# EAGLE design badge_arvore_natal (EAGLE 9.6.2)
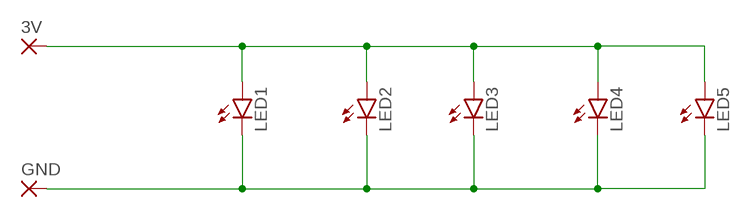
[diagram p0: schematic, sheet 1]

## Parts
3V  SMD2  [SMD1,27-2,54]
GND  SMD2  [SMD1,27-2,54]
LED1  LEDCHIPLED_0805  [CHIPLED_0805]
LED2  LEDCHIPLED_0805  [CHIPLED_0805]
LED3  LEDCHIPLED_0805  [CHIPLED_0805]
LED4  LEDCHIPLED_0805  [CHIPLED_0805]
LED5  LEDCHIPLED_0805  [CHIPLED_0805]

## Nets
N$1: 3V.1(P) LED1.A LED2.A LED3.A LED4.A LED5.A
N$2: GND.1(P) LED1.C LED2.C LED3.C LED4.C LED5.C

## Library data of the parts
3V GND = wirepad:SMD2: SMD PAD
LED1-LED5 = led:LED: LED OSRAM: - CHIPLED LG R971, LG N971, LY N971, LG Q971, LY Q971, LO R971, LY R971 LH N974, LH R974 LS Q976, LO Q976, LY Q976 LO Q996 - Hyper CHIPLED LW Q18S LB Q993, LB Q99A, LB R99A - SideLED LS A670, LO A670, LY A670, LG A670, LP A670 LB A673, LV A673, LT A673, LW A673 LH A674 LY A675 LS A676, LA A676, LO A676, LY A676, LW A676 LS A679, LY A679, LG A679 - Hyper Micro SIDELED® LS Y876, LA Y876, LO Y876, LY Y876 LT Y87S - SmartLED LW L88C, LW L88S LB L89C, LB L89S, LG L890 LS L89K, LO L89K, LY L89K LS L896, LA L896, LO L896, LY L896 - TOPLED LS T670, LO T670, LY T670, LG T670, LP T670 LSG T670, LSP T670, LSY T670, LOP T670, LYG T670 LG T671, LOG T671, LSG T671 LB T673, LV T673, LT T673, LW T673 LH T674 LS T676, LA T676, LO T676, LY T676, LB T676, LH T676, LSB T676, LW T676 LB T67C, LV T67C, LT T67C, LS T67K, LO T67K, LY T67K, LW E67C LS E67B, LA E67B, LO E67B, LY E67B, LB E67C, LV E67C, LT E67C LW T67C LS T679, LY T679, LG T679 LS T770, LO T770, LY T770, LG T770, LP T770 LB T773, LV T773, LT T773, LW T773 LH T774 LS E675, LA E675, LY E675, LS T675 LS T776, LA T776, LO T776, LY T776, LB T776 LHGB T686 LT T68C, LB T68C - Hyper Mini TOPLED® LB M676 - Mini TOPLED Santana® LG M470 LS M47K, LO M47K, LY M47K Source: http://www.osram.convergy.de LUXEON: - LUMILED® LXK2-PW12-R00, LXK2-PW12-S00, LXK2-PW14-U00, LXK2-PW14-V00 LXK2-PM12-R00, LXK2-PM12-S00, LXK2-PM14-U00 LXK2-PE12-Q00, LXK2-PE12-R00, LXK2-PE12-S00, LXK2-PE14-T00, LXK2-PE14-U00 LXK2-PB12-K00, LXK2-PB12-L00, LXK2-PB12-M00, LXK2-PB14-N00, LXK2-PB14-P00, LXK2-PB14-Q00 LXK2-PR12-L00, LXK2-PR12-M00, LXK2-PR14-Q00, LXK2-PR14-R00 LXK2-PD12-Q00, LXK2-PD12-R00, LXK2-PD12-S00 LXK2-PH12-R00, LXK2-PH12-S00 LXK2-PL12-P00, LXK2-PL12-Q00, LXK2-PL12-R00 Source: www.luxeon.com KINGBRIGHT: KA-3528ASYC Source: www.kingbright.com

## Board
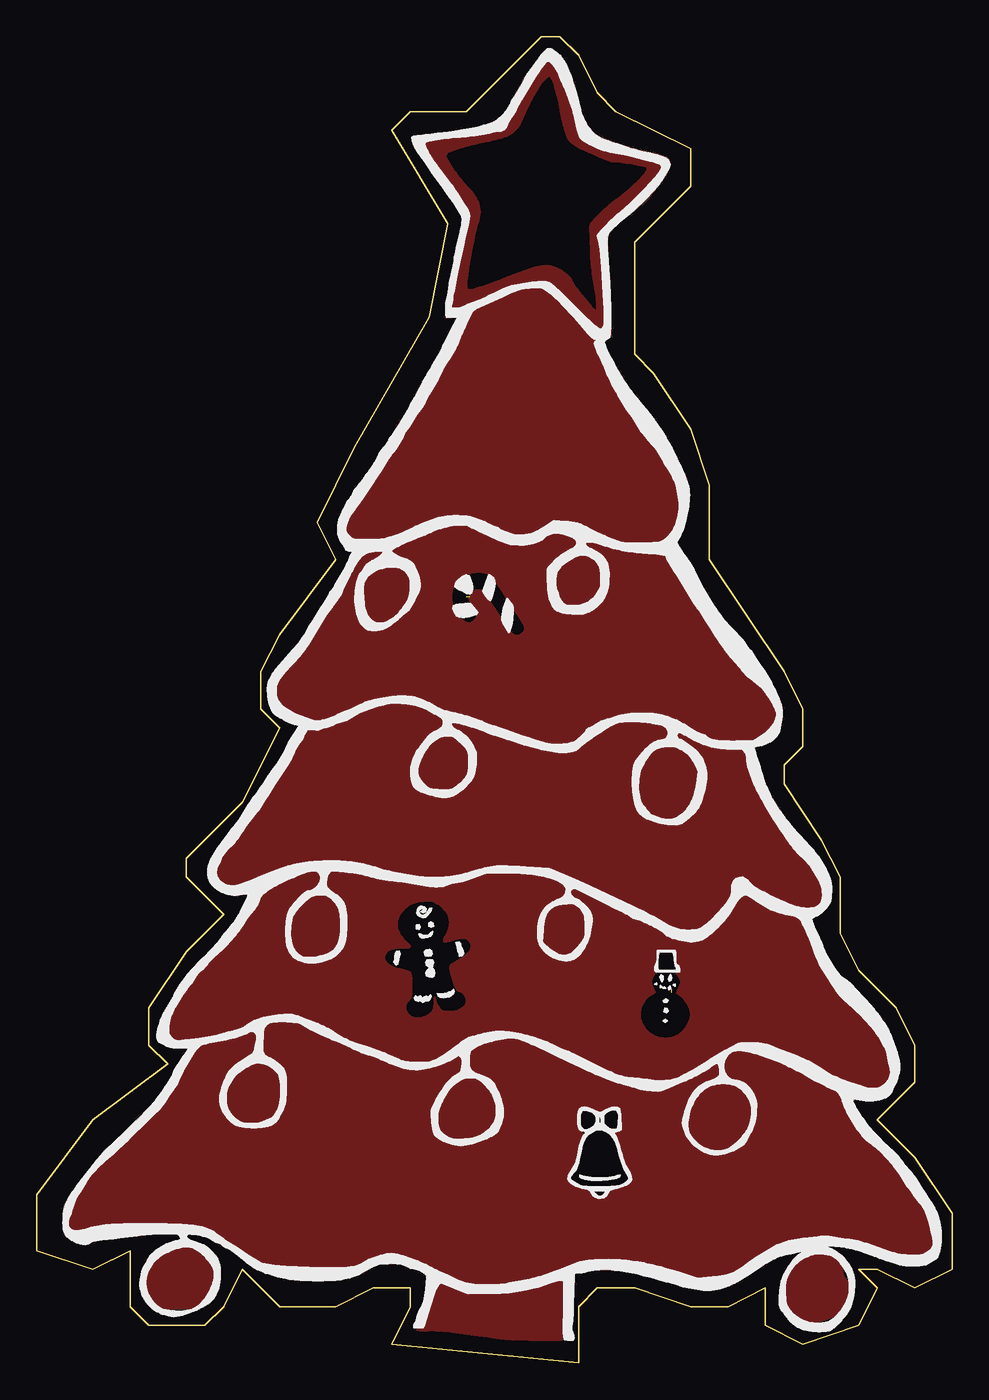
[diagram p1: board, top side]
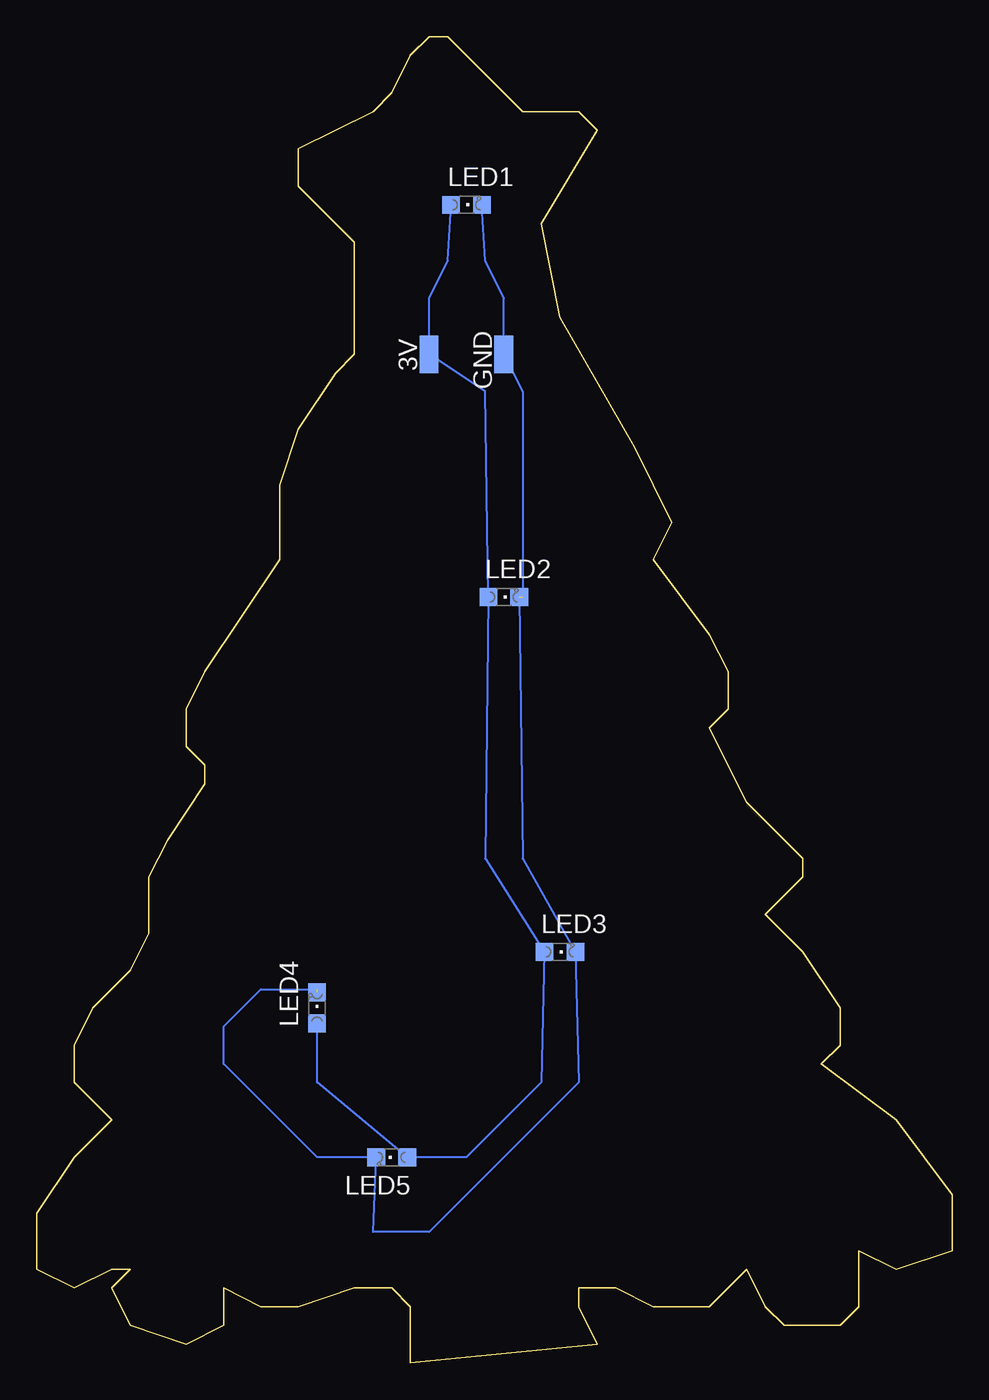
[diagram p2: board, bottom side, seen from below]

Size 62.23 x 90.17 mm. Coordinates in mm from the lower left corner, seen from the top.
Outline: 34.29,90.17 35.56,90.17 36.83,88.9 38.1,86.36 39.37,85.09 44.45,82.55 44.45,80.01 40.64,76.2 40.64,68.58 41.91,67.31 44.45,63.5 45.72,59.69 45.72,54.61 50.8,46.99 52.07,44.45 52.07,41.91 50.8,40.64 50.8,39.37 53.34,35.56 54.61,33.02 54.61,29.21 55.88,26.67 58.42,24.13 59.69,21.59 59.69,19.05 57.15,16.51 59.69,13.97 62.23,10.16 62.23,6.35 59.69,5.08 57.15,6.35 55.88,6.35 57.15,5.08 55.88,2.54 52.07,1.27 49.53,2.54 49.53,5.08 46.99,3.81 44.45,3.81 40.64,5.08 38.1,5.08 36.83,3.81 36.83,0 24.13,1.27 25.4,3.81 25.4,5.08 22.86,5.08 20.32,3.81 16.51,3.81 13.97,6.35 12.7,3.81 11.43,2.54 7.62,2.54 6.35,3.81 6.35,7.62 3.81,6.35 0,7.62 0,11.43 3.81,16.51 8.89,20.32 7.62,21.59 7.62,24.13 10.16,27.94 12.7,30.48 10.16,33.02 10.16,34.29 13.97,38.1 16.51,43.18 15.24,44.45 15.24,46.99 16.51,49.53 20.32,54.61 19.05,57.15 21.59,62.23 26.67,71.12 27.94,77.47 24.13,83.82 25.4,85.09 29.21,85.09 34.29,90.17
Copper layers (1*16): Top 0.035mm / dielectric 1.5mm / Bottom 0.035mm
Design rules "default": minimum track width 6mil, minimum drill 0.35mm, track to track 6mil, track to pad 6mil, pad to pad 6mil, via to via 6mil, smd to smd 6mil, copper to edge 40mil, drill to drill 6mil, minimum pad ring 10mil, minimum via ring 8mil, stop-mask expansion 4mil, vias tented up to drill 0mil, thermal gap 10mil

### Footprints (pad centres in the part's own frame; a part is rotated, then mirrored left to right if it is on the bottom)
SMD1,27-2,54 = smd 1.27 x 2.54: 1 0,0
CHIPLED_0805 = smd 1.2 x 1.2: A 0,-1.05; C 0,1.05

### Placement (x,y rotation side)
3V  35.56,68.58 0 bottom
GND  30.48,68.58 0 bottom
LED1  33.02,78.74 270 bottom
LED2  30.48,52.07 270 bottom
LED3  26.67,27.94 270 bottom
LED4  43.18,24.13 0 bottom
LED5  38.1,13.97 90 bottom

### Tracks (layer width: path | path; a pad name or v marks a point on that pad's centre or on a via)
GND
  pour Top (rank 3): 1884 corners
N$1
  Bottom 0.152: LED1.A 34.29,74.93 35.56,72.39 3V.1 31.75,66.04 LED2.A 31.75,34.29 LED3.A 27.94,19.05 33.02,13.97 LED5.A 43.18,19.05 LED4.A
N$2  (2 unrouted)
  Bottom 0.152: LED1.C 31.75,74.93 30.48,72.39 GND.1 29.21,66.04 29.21,52.07 | LED2.C 29.21,34.29 LED3.C 25.4,19.05 35.56,8.89 39.37,8.89 LED5.C 43.18,13.97 49.53,20.32 49.53,22.86 46.99,25.4 43.18,25.4